# EAGLE design AXAWIFIESP01 (EAGLE 9.6.1)
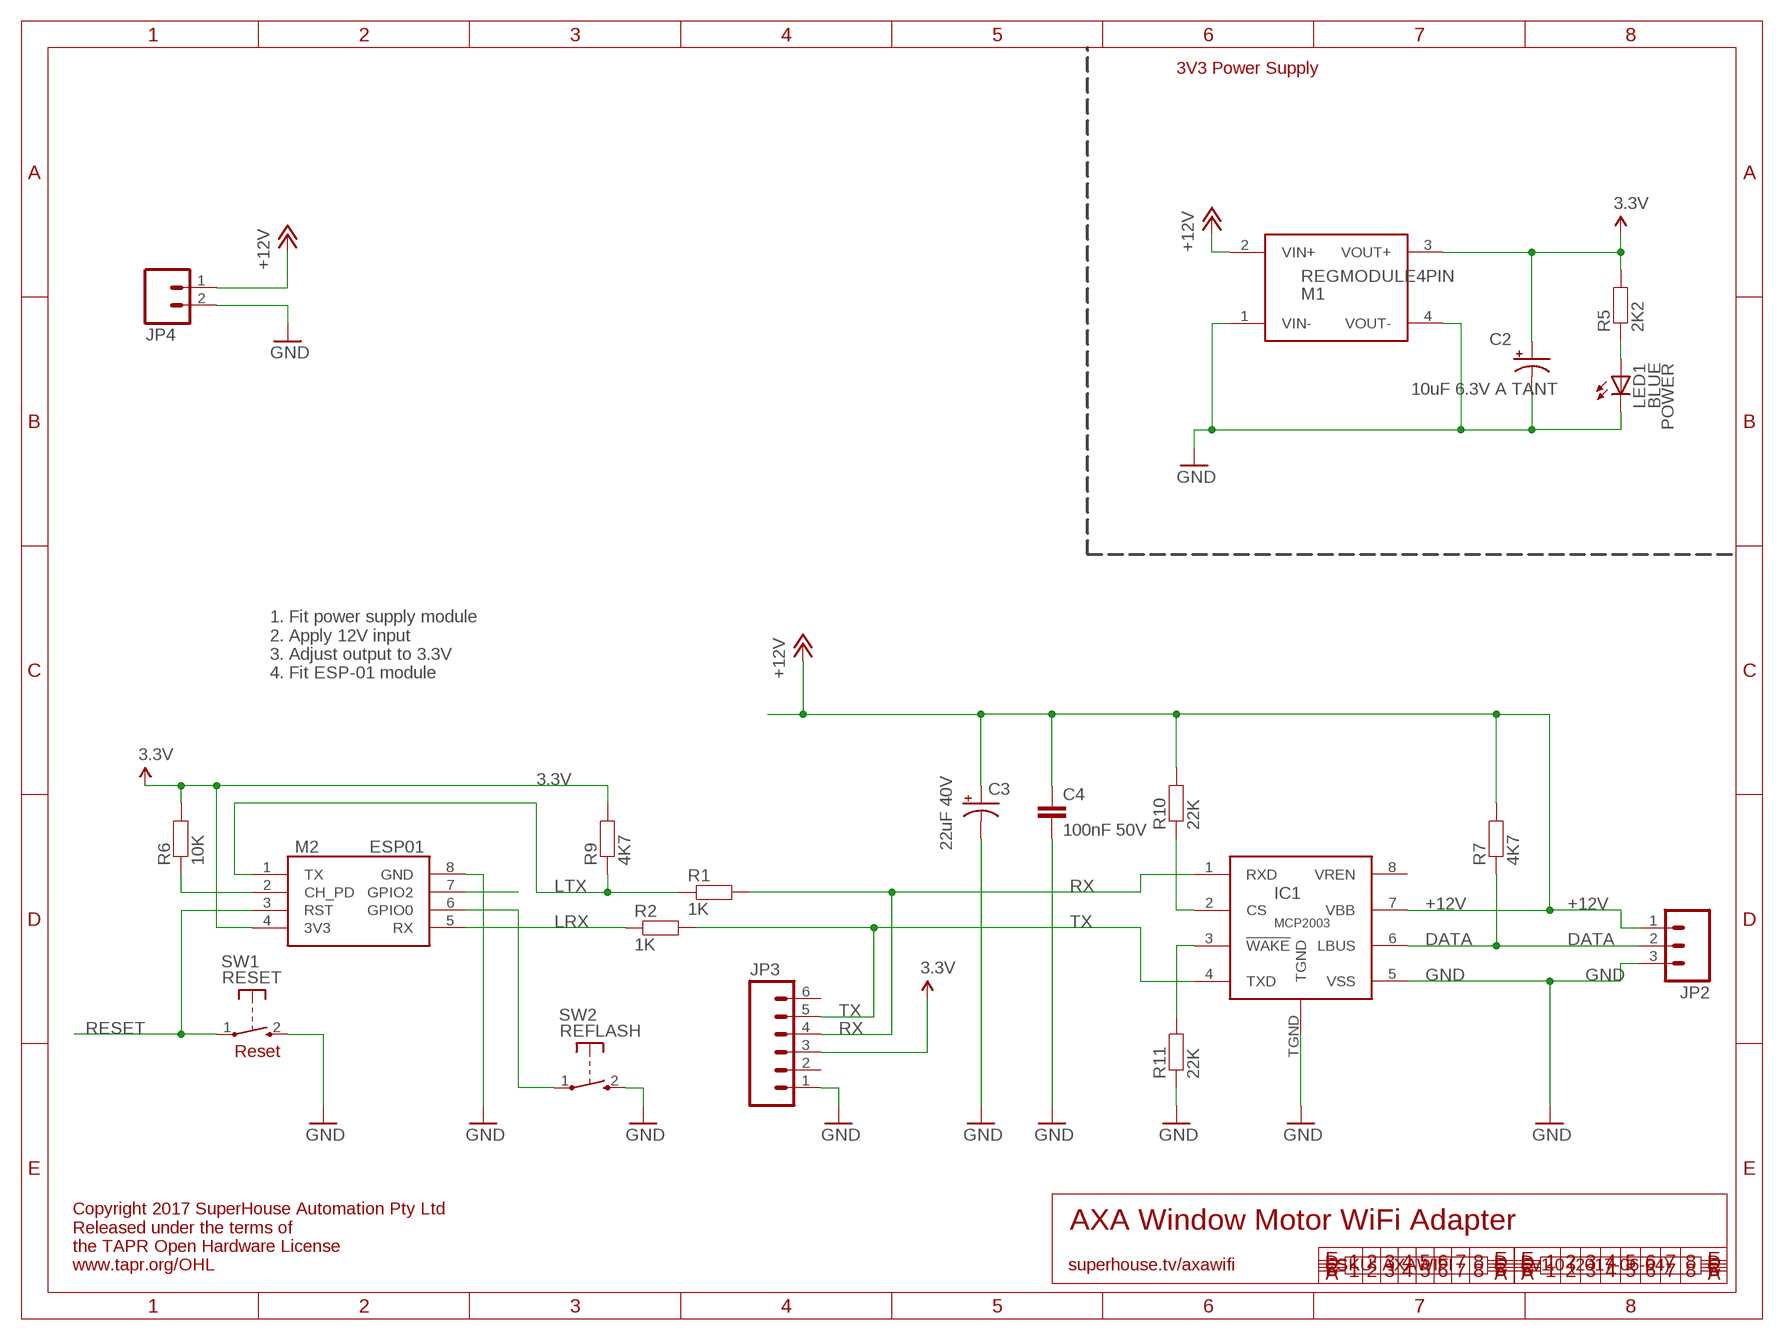
[diagram p0: schematic, sheet 1]

## Parts
C2  10uF 6.3V A TANT  CAP_POL1206  [EIA3216]
C3  22uF 40V  CAP_POLC  [PANASONIC_C]
C4  100nF 50V  CAP0603  [C0603]
IC1  MCP2003  [SOIC8T]
JP2  M03PTH  [1X03]
JP3  M06SIP  [1X06]
JP4  M02-SCREW-3.5MM  [SCREWTERMINAL-3.5MM-2]
LED1  BLUE  LED0603  [LED-0603]
M1  REGMODULE4PIN  [REGMODULE4PIN]
M2  ESP01  [ESP01]
R1  1K  RESISTOR0603  [R0603]
R2  1K  RESISTOR0603  [R0603]
R5  2K2  RESISTOR0603  [R0603]
R6  10K  RESISTOR0603  [R0603]
R7  4K7  RESISTOR0603  [R0603]
R9  4K7  RESISTOR0603  [R0603]
R10  22K  RESISTOR0603  [R0603]
R11  22K  RESISTOR0603  [R0603]
SW1  RESET  TAC_SWITCH_2PINSMT  [TACTILE_SMT_3X4X2]
SW2  REFLASH  TAC_SWITCH_2PINSMT  [TACTILE_SMT_3X4X2]

## Nets
3.3V: C2.A(+) JP3.3 M1.3(VOUT+) M2.4(3V3) R5.2 R6.2 R9.2
+12V: C3.+ C4.1 IC1.7(VBB) JP2.1 JP4.1 M1.2(VIN+) R7.2 R10.2
DATA: IC1.6(LBUS) JP2.2 R7.1
GND: C2.C(-) C3.- C4.2 IC1.5(VSS) IC1.TGND JP2.3 JP3.1 JP4.2 LED1.C M1.1(VIN-) M1.4(VOUT-) M2.8(GND) R11.1 SW1.2(S) SW2.2(S)
LRX: M2.5(RX) R2.1
LTX: M2.1(TX) R1.1 R9.1
N$1: M2.6(GPIO0) SW2.1(P)
N$2: M2.7(GPIO2)
N$4: M2.2(CH_PD) R6.1
N$5: IC1.2(CS) R10.1
N$6: IC1.3(!WAKE) R11.2
N$14: LED1.A R5.1
RESET: M2.3(RST) SW1.1(P)
RX: IC1.1(RXD) JP3.4 R1.2
TX: IC1.4(TXD) JP3.5 R2.2
Unconnected: IC1.8(VREN) JP3.2 JP3.6

## Notes on the sheet
- 3V3 Power Supply
- POWER
- 1. Fit power supply module
  2. Apply 12V input
  3. Adjust output to 3.3V
  4. Fit ESP-01 module
- Reset
- AXA Window Motor WiFi Adapter
- Copyright 2017 SuperHouse Automation Pty Ltd
  Released under the terms of
  the TAPR Open Hardware License
  www.tapr.org/OHL
- superhouse.tv/axawifi | SKU: AXAWIFI | v1.0 (2017-06-04)

## Library data of the parts
C2 C3 = SuperHouse-DiscreteSemi:CAP_POL: Capacitor Polarized These are standard SMD and PTH capacitors. Normally 10uF, 47uF, and 100uF in electrolytic and tantalum varieties. Always verify the external diameter of the through hole cap, it varies with capacity, voltage, and manufacturer. The EIA devices should be standard.
C4 = SuperHouse-DiscreteSemi:CAP: Capacitor Standard ceramic capacitor
IC1 = SuperHouse-ICs:MCP2003: MCP2003 LIN bus driver
JP2 = freetronics-jon:M03: Header 3 Standard 3-pin 0.1" header. Use with straight break away headers (SKU : PRT-00116), right angle break away headers (PRT-00553), swiss pins (PRT-00743), machine pins (PRT-00117), and female headers (PRT-00115). Molex polarized connector foot print use with SKU : PRT-08232 with associated crimp pins and housings.
JP3 = freetronics-master-v1:M06: Header 6 Standard 6-pin 0.1" header. Use with straight break away headers (SKU : PRT-00116), right angle break away headers (PRT-00553), swiss pins (PRT-00743), machine pins (PRT-00117), and female headers (PRT-00115). Molex polarized connector foot print use with SKU : PRT-08094 with associated crimp pins and housings. NOTES ON THE VARIANTS LOCK and LOCK_LONGPADS... This footprint was designed to help hold the alignment of a through-hole component (i.e. 6-pin header) while soldering it into place. You may notice that each hole has been shifted either up or down by 0.005 of an inch from it's more standard position (which is a perfectly straight line). This slight alteration caused the pins (the squares in the middle) to touch the edges of the holes. Because they are alternating, it causes a "brace" to hold the component in place. 0.005 has proven to be the perfect amount of "off-center" position when using our standard breakaway headers. Although looks a little odd when you look at the bare footprint, once you have a header in there, the alteration is very hard to notice. Also, if you push a header all the way into place, it is covered up entirely on the bottom side. This idea of altering the position of holes to aid alignment will be further integrated into the Sparkfun Library for other footprints. It can help hold any component with 3 or more connection pins.
JP4 = SuperHouse-Connectors:M02: 2-way header Standard 1x2 header, and screw terminal variations
LED1 = SuperHouse-LEDs:LED: LEDs Standard schematic elements and footprints for 5mm, 3mm, 1206, and 0603 sized LEDs. 5mm - Spark Fun Electronics SKU : COM-00529 (and others)
M1 = freetronics-jon:REGMODULE4PIN
M2 = freetronics-jon:ESP01
R1 R2 R5-R7 R9-R11 = SuperHouse-DiscreteSemi:RESISTOR: Resistor Standard resistors.
SW1 SW2 = SuperHouse-Switches:TAC_SWITCH_2PIN: Momentary Tactile Switch - 2 pin Uxcell 3x4x2mm switch with 2 SMT pads

## Board
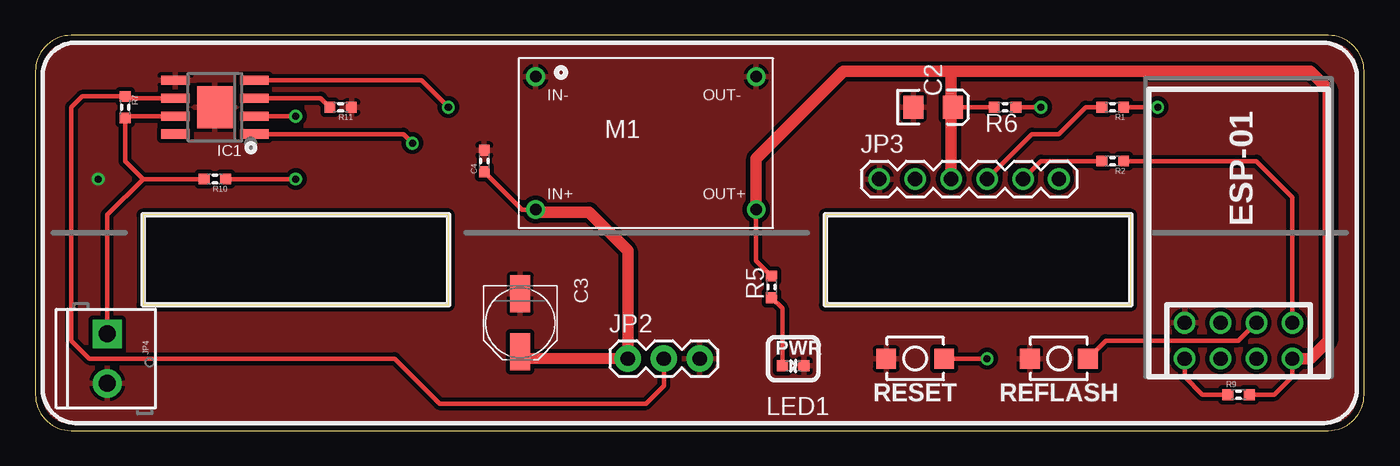
[diagram p1: board, top side]
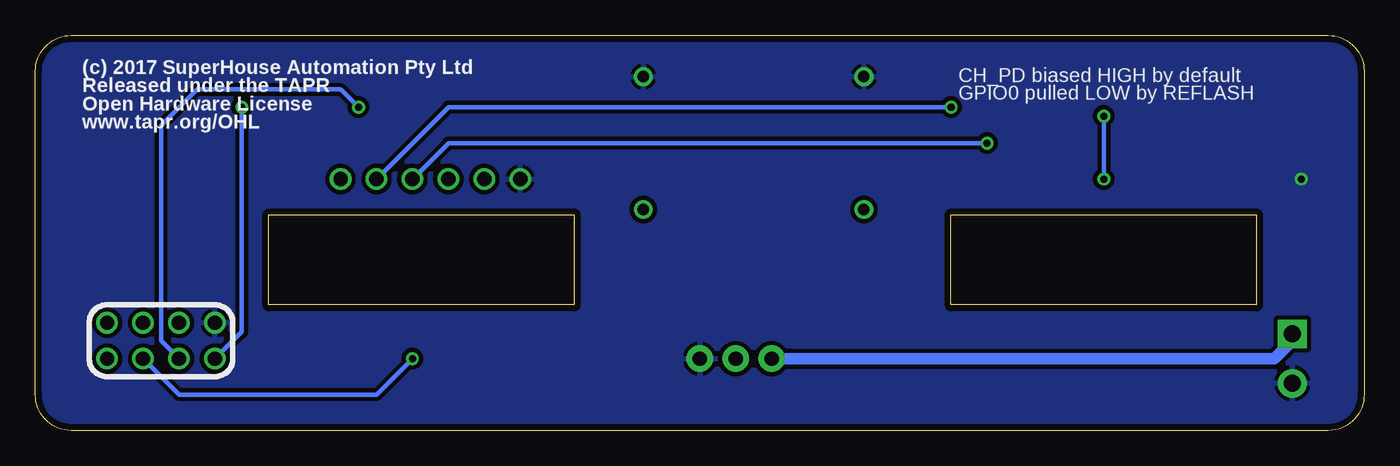
[diagram p2: board, bottom side, seen from below]

Size 93.98 x 27.94 mm. Coordinates in mm from the lower left corner, seen from the top.
Outline: 0,2.54 arc90 2.54,0 91.44,0 arc90 93.98,2.54 93.98,25.4 arc90 91.44,27.94 2.54,27.94 arc90 0,25.4 0,2.54
Outline: 7.62,15.24 7.62,8.89 29.21,8.89 29.21,15.24 7.62,15.24
Outline: 55.88,15.24 55.88,8.89 77.47,8.89 77.47,15.24 55.88,15.24
Copper layers (1*16): Top 0.035mm / dielectric 1.5mm / Bottom 0.035mm
Design rules "default *": minimum track width 10mil, minimum drill 24mil, track to track 12mil, track to pad 12mil, pad to pad 12mil, via to via 12mil, smd to smd 8mil, copper to edge 18mil, drill to drill 8mil, minimum pad ring 10mil, minimum via ring 8mil, stop-mask expansion 4mil, vias tented up to drill 20mil, thermal gap 10mil

### Footprints (pad centres in the part's own frame; a part is rotated, then mirrored left to right if it is on the bottom)
EIA3216 = smd 1.4 x 1.6: A 1.4,0; C -1.4,0
PANASONIC_C = smd 2.6 x 1.4: + 2.05,0; - -2.05,0
C0603 = smd 0.762 x 0.762: 1 -0.762,0; 2 0.762,0
SOIC8T = smd 2.032 x 0.66: 1 -2.794,1.905; 2 -2.794,0.635; 3 -2.794,-0.635; 4 -2.794,-1.905; 5 2.794,-1.905; 6 2.794,-0.635; 7 2.794,0.635; 8 2.794,1.905 | smd 2.489 x 2.997: TGND 0,0
1X03 = drill 1.016 pad 1.88: 1 0,0; 2 2.54,0; 3 5.08,0
1X06 = drill 1.016: 1 0,0; 2 2.54,0; 3 5.08,0; 4 7.62,0; 5 10.16,0; 6 12.7,0
SCREWTERMINAL-3.5MM-2 = drill 1.2 pad 2.032 square: 1 -1.75,0 | drill 1.2 pad 2.032: 2 1.75,0
LED-0603 = smd 0.762 x 0.762: A -0.762,0; C 0.762,0
REGMODULE4PIN = drill 0.813 pad 1.27: 1 -7.8,4.7; 2 -7.8,-4.7; 3 7.8,-4.7; 4 7.8,4.7
ESP01 = drill 1.016: 1 -1.27,3.81; 2 -1.27,1.27; 3 -1.27,-1.27; 4 -1.27,-3.81; 5 1.27,-3.81; 6 1.27,-1.27; 7 1.27,1.27; 8 1.27,3.81
R0603 = smd 0.762 x 0.762: 1 -0.762,0; 2 0.762,0
TACTILE_SMT_3X4X2 = smd 1.4 x 1.4: 1 -2.05,0; 2 2.05,0

### Placement (x,y rotation side)
C2  63.5,22.86 0 top
C3  34.29,7.62 270 top
C4  31.75,19.05 90 top
IC1  12.7,22.86 180 top
JP2  41.91,5.08 0 top
JP3  59.69,17.78 0 top
JP4  5.08,5.08 270 top
LED1  53.59,4.57 0 top
M1  43.18,20.32 0 top
M2  85.09,6.35 90 top
R1  76.2,22.86 180 top
R2  76.2,19.05 180 top
R5  52.07,10.16 90 top
R6  68.58,22.86 180 top
R7  6.35,22.86 270 top
R9  85.09,2.54 0 top
R10  12.7,17.78 180 top
R11  21.59,22.86 180 top
SW1  62.23,5.08 180 top
SW2  72.39,5.08 180 top

### Tracks (layer width: path | path; a pad name or v marks a point on that pad's centre or on a via)
3.3V
  Top 0.305: R9.2 87.63,2.54 88.9,3.81 M2.4 | R5.2 50.98,12.01 M1.3 | R6.2 C2.A
  Top 0.813: M1.3 50.98,19.23 57.15,25.4 64.77,25.4 | 64.77,25.4 90.17,25.4 91.44,24.13 91.44,6.35 90.17,5.08 M2.4 | 64.77,25.4 64.77,22.99 C2.A 64.77,22.73 JP3.3
+12V
  Top 0.305: IC1.7 6.48,22.23 R7.2 6.35,19.05 7.62,17.78 | R10.2 7.62,17.78 | JP4.1 5.08,15.24 7.62,17.78 | M1.2 34.42,15.62 C4.1
  Top 0.813: M1.2 35.56,15.44 39.17,15.44 41.91,12.7 JP2.1 41.87,5.12 34.29,5.08 C3.+
  Bottom 0.813: JP2.1 40.64,5.08 6.35,5.08 5.08,6.35 JP4.1
DATA
  Top 0.305: IC1.6 6.48,23.5 R7.1 3.3,23.62 2.54,22.86 2.54,6.35 3.81,5.08 25.4,5.08 28.57,1.91 43.18,1.91 44.45,3.17 JP2.2
GND  (via drill 0.5)
  other vias: 4.45,17.78
  pour Bottom: 0,25.4 arc-90 2.54,27.94 91.44,27.94 arc-90 93.98,25.4 93.98,2.54 arc-90 91.44,0 2.54,0 arc-90 0,2.54
  pour Top: 0,25.4 arc-90 2.54,27.94 91.44,27.94 arc-90 93.98,25.4 93.98,2.54 arc-90 91.44,0 2.54,0 arc-90 0,2.54
LRX
  Top 0.305: R2.1 86.36,19.05 88.9,16.51 M2.5
LTX  (via drill 0.5)
  Top 0.305: R9.1 82.55,2.54 81.28,3.81 M2.1 | R1.1 v79.38,22.86
  Bottom 0.305: v79.38,22.86 79.38,6.99 M2.1
N$1
  Top 0.305: SW2.1 75.71,6.35 85.09,6.35 M2.6
N$4  (via drill 0.5)
  Top 0.305: v71.12,22.86 R6.1
  Bottom 0.305: M2.2 85.09,6.35 85.09,21.59 82.55,24.13 72.39,24.13 v71.12,22.86
N$5  (via drill 0.5)
  Top 0.305: IC1.2 v18.41,22.23 | v18.41,17.78 R10.1
  Bottom 0.305: v18.41,22.23 v18.41,17.78
N$6
  Top 0.305: IC1.3 20.19,23.5 R11.2
N$14
  Top 0.305: R5.1 52.83,8.64 LED1.A
RESET  (via drill 0.5)
  Top 0.305: SW1.1 v67.31,5.08
  Bottom 0.305: v67.31,5.08 69.85,2.54 83.82,2.54 M2.3
RX  (via drill 0.5)
  Top 0.305: IC1.1 26.04,20.95 v26.67,20.32 | JP3.4 70.48,20.95 72.39,20.95 74.3,22.86 R1.2
  Bottom 0.305: v26.67,20.32 64.77,20.32 JP3.4
TX  (via drill 0.5)
  Top 0.305: IC1.4 27.3,24.77 v29.21,22.86 | JP3.5 71.12,19.05 R2.2
  Bottom 0.305: v29.21,22.86 64.77,22.86 JP3.5

### Text on the board
tPlace: ESP-01 | PWR | RESET | REFLASH
bPlace: CH_PD biased HIGH by default / GPIO0 pulled LOW by REFLASH | (c) 2017 SuperHouse Automation Pty Ltd / Released under the TAPR / Open Hardware License / www.tapr.org/OHL
tDocu: K | A